# EAGLE board SparkFun_Stepoko (EAGLE 7.1.0)
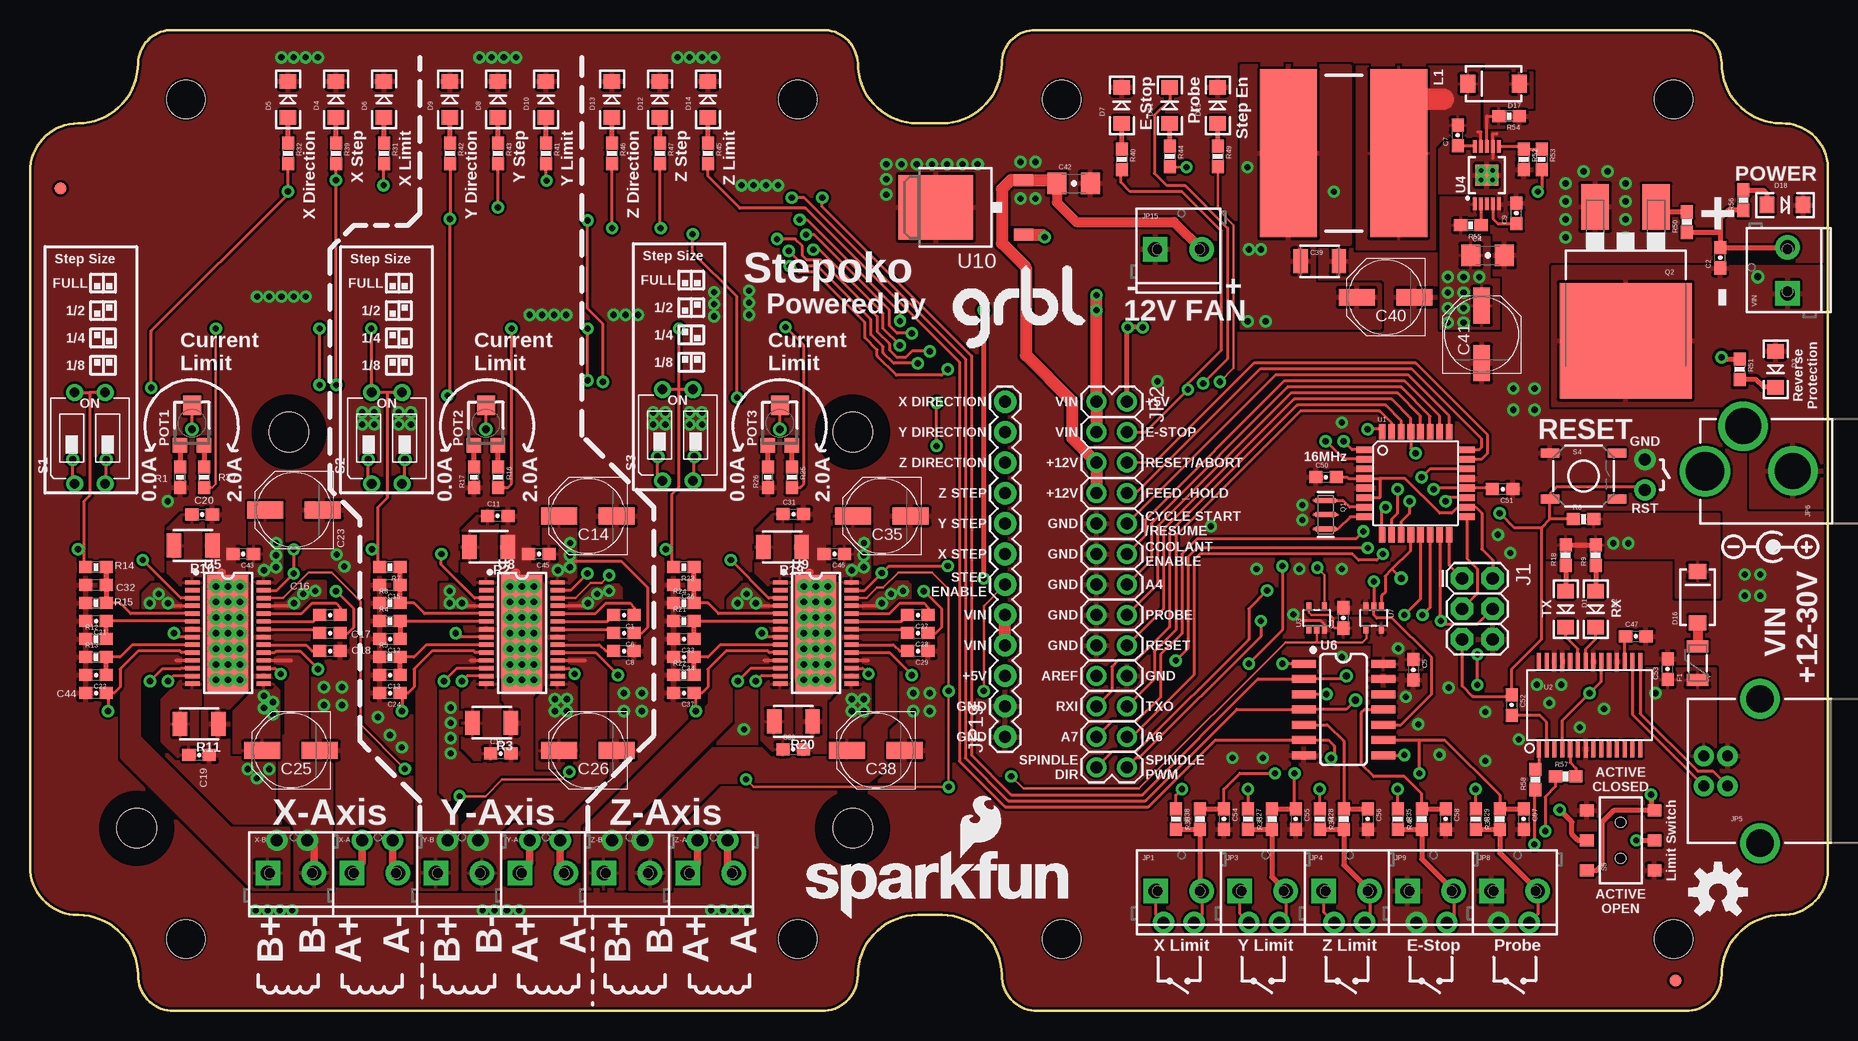
[diagram p2: board, top side]
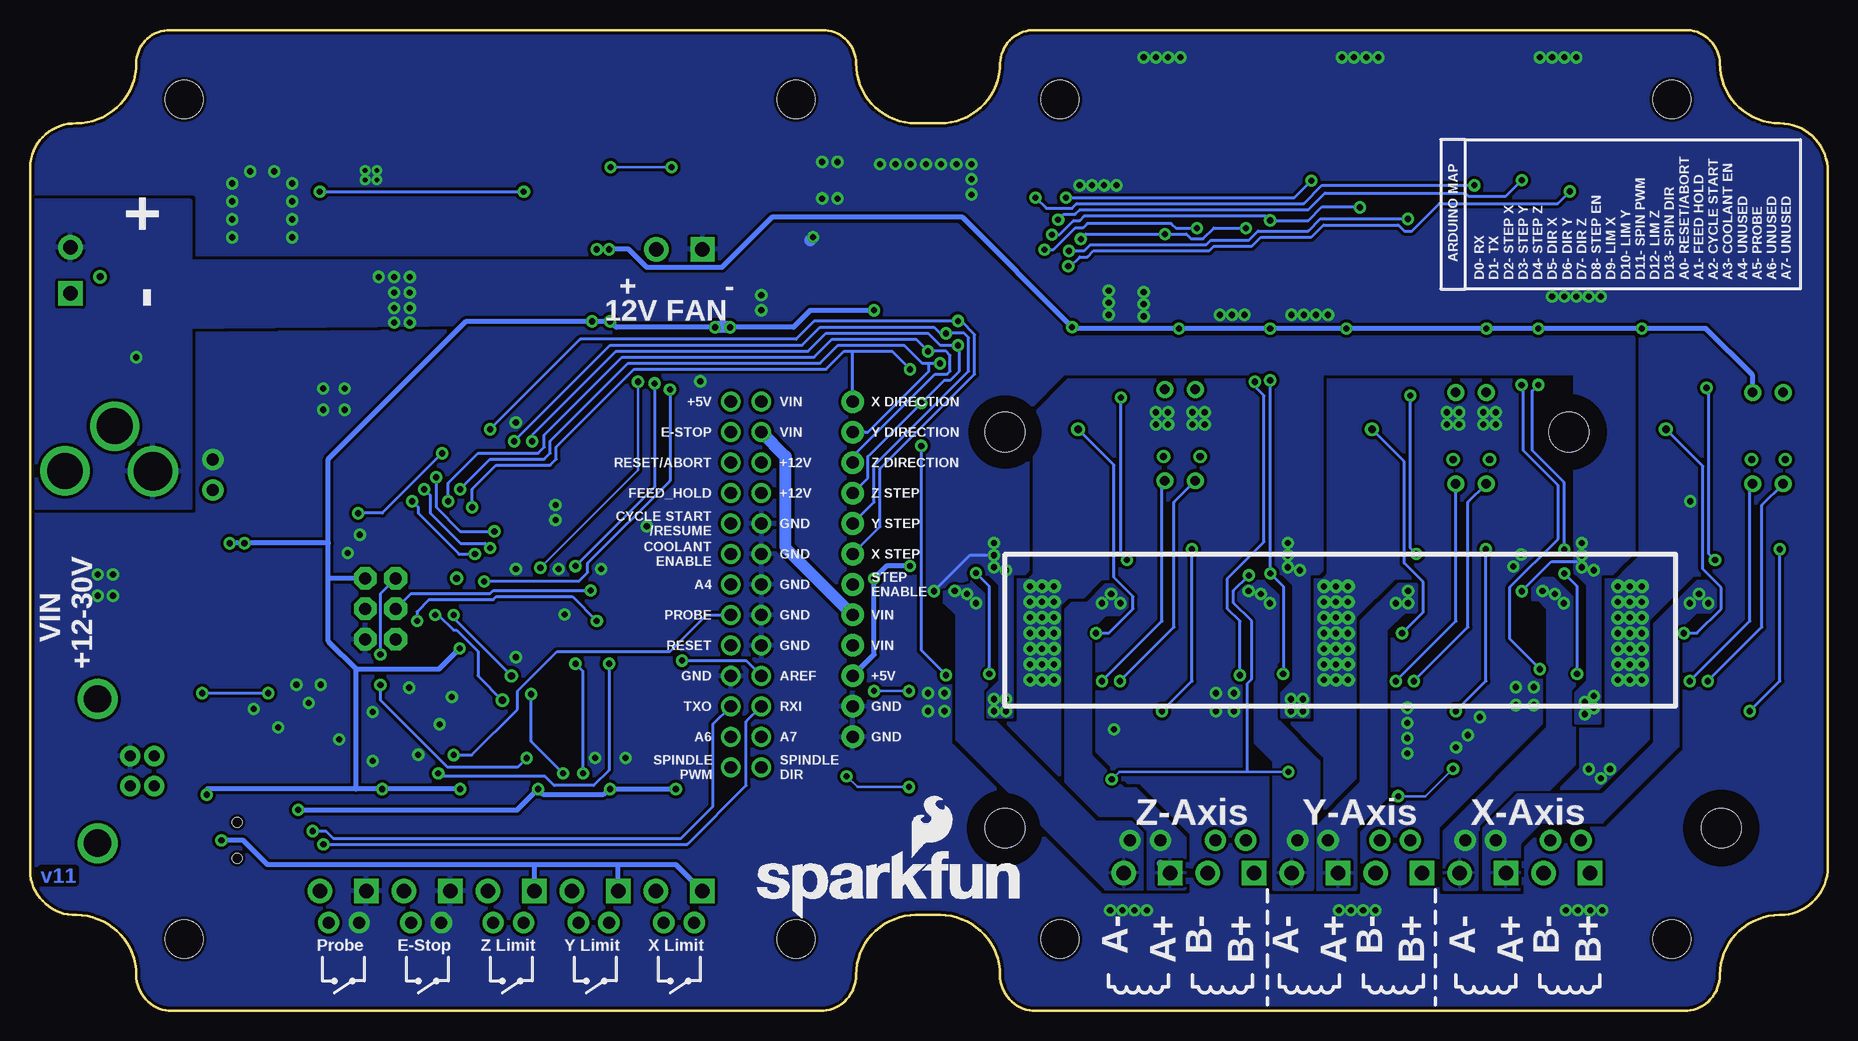
[diagram p3: board, bottom side, seen from below]

Size 149.86 x 81.79 mm. Coordinates in mm from the lower left corner, seen from the top.
Copper layers (1*16): Top 0.035mm / dielectric 1.5mm / Bottom 0.035mm
Design rules "SparkFun-2-layer": minimum track width 7mil, minimum drill 15mil, track to track 8mil, track to pad 8mil, pad to pad 8mil, via to via 8mil, smd to smd 8mil, copper to edge 8mil, drill to drill 8mil, minimum pad ring 12mil, minimum via ring 10mil, stop-mask expansion 4mil, vias tented up to drill 20mil, thermal gap 10mil
tRestrict: area 6.1,12.4 to 11.7,18; area 65.8,12.4 to 71.4,18; area 65.8,45.5 to 71.4,51.1; area 18.8,45.5 to 24.4,51.1; 1 lines
bRestrict: area 18.8,45.5 to 24.4,51.1; area 65.8,12.4 to 71.4,18; area 6.1,12.4 to 11.7,18; area 65.9,45.6 to 71.2,50.9

## Footprints (pad centres in the part's own frame; a part is rotated, then mirrored left to right if it is on the bottom)
0603-CAP = smd 1.1 x 1: 1 -0.85,0; 2 0.85,0
1206-CAP = smd 1.6 x 1.8: 1 -1.4,0; 2 1.4,0
PANASONIC_D = smd 3 x 1.4: + 2.4,0; - -2.4,0
0603 = smd 1.1 x 1: 1 -0.85,0; 2 0.85,0
1210 = smd 1.2 x 2: 1 -1.6,0; 2 1.6,0
LED-1206 = smd 1.2 x 1.4: A -1.5,0; C 1.5,0
SMA-DIODE = smd 1.27 x 1.47: A -2.15,0; C 2.15,0
PTC-1206 = smd 1 x 1.8: 1 -1.4,0; 2 1.4,0
FIDUCIAL-1X2 = smd 1 x 1: 1 0,0
2X3 = drill 1.016 pad 1.88 octagon: 1 0,0; 2 0,2.54; 3 2.54,0; 4 2.54,2.54; 5 5.08,0; 6 5.08,2.54
SCREWTERMINAL-3.5MM-2_LOCK = drill 1.2 pad 2.032 square: 1 -0.178,0 | drill 1.2 pad 2.032: 2 3.678,0
2X13 = drill 1.016 pad 1.651: 1 0,0; 2 0,2.54; 3 2.54,0; 4 2.54,2.54; 5 5.08,0; 6 5.08,2.54; 7 7.62,0; 8 7.62,2.54; 9 10.16,0; 10 10.16,2.54; 11 12.7,0; 12 12.7,2.54; 13 15.24,0; 14 15.24,2.54; 15 17.78,0; 16 17.78,2.54; 17 20.32,0; 18 20.32,2.54; 19 22.86,0; 20 22.86,2.54; 21 25.4,0; 22 25.4,2.54; 23 27.94,0; 24 27.94,2.54; 25 30.48,0; 26 30.48,2.54
USB-B-PTH = drill 0.914 pad 1.676: D+ 0,1.25; D- 1.981,1.25; GND 0,-1.25; VBUS 1.981,-1.25 | drill 2.286: S1 -2.718,-6.02; S2 -2.718,6.02
POWER_JACK_PTH_LOCK = drill 2.997 pad 4.115: GND 0.025,6.557; GNDBREAK 3.762,10.7 | drill 3.2 pad 4.115: PWR 0,13.878
1X12 = drill 1.016 pad 1.88: 1 0,0; 2 2.54,0; 3 5.08,0; 4 7.62,0; 5 10.16,0; 6 12.7,0; 7 15.24,0; 8 17.78,0; 9 20.32,0; 10 22.86,0; 11 25.4,0; 12 27.94,0
INDUCTOR_SDR1307 = smd 14 x 4.75: P$1 0,4.6; P$2 0,-4.6
TC33X = smd 1.2 x 1.2: 1 -1,-1.825; 3 1,-1.825 | smd 1.5 x 1.6: 2 0,1.5
RESONATOR-SMD = smd 0.45 x 1.905: 1 -1.2,0; 2 0,0; 3 1.2,0
TO-263/D2PAK = smd 2.32 x 3.81: 1 -2.54,-7.045; 3 2.54,-7.045 | smd 11 x 9.65: 2 0,4.125
0603-RES = smd 1.1 x 1: 1 -0.85,0; 2 0.85,0
0603-RES@1 = smd 1.1 x 1: 1 -0.85,0; 2 0.85,0
209-2LPST = drill 0.8: 1 -1.27,-3.81; 2 1.27,-3.81; 3 1.27,3.81; 4 -1.27,3.81
TACTILE-SWITCH-SMD = smd 1.524 x 0.762: 1 -2.794,1.905; 2 2.794,1.905; 3 -2.794,-1.905; 4 2.794,-1.905
AYZ0202 = smd 1 x 1.15: 1 -2.5,2.825; 2 0,2.825; 3 2.5,2.825; 4 -2.5,-2.825; 5 0,-2.825; 6 2.5,-2.825 | hole 0.85: 1.5,0; -1.5,0
TQFP32-08@1 = smd 1.27 x 0.559: 1 -4.293,2.8; 2 -4.293,2; 3 -4.293,1.2; 4 -4.293,0.4; 5 -4.293,-0.4; 6 -4.293,-1.2; 7 -4.293,-2; 8 -4.293,-2.8; 17 4.293,-2.8; 18 4.293,-2; 19 4.293,-1.2; 20 4.293,-0.4; 21 4.293,0.4; 22 4.293,1.2; 23 4.293,2; 24 4.293,2.8 | smd 0.559 x 1.27: 9 -2.8,-4.293; 10 -2,-4.293; 11 -1.2,-4.293; 12 -0.4,-4.293; 13 0.4,-4.293; 14 1.2,-4.293; 15 2,-4.293; 16 2.8,-4.293; 25 2.8,4.293; 26 2,4.293; 27 1.2,4.293; 28 0.4,4.293; 29 -0.4,4.293; 30 -1.2,4.293; 31 -2,4.293; 32 -2.8,4.293
SSOP28DB = smd 0.348 x 1.397: 1 -4.225,-3.656; 2 -3.575,-3.656; 3 -2.925,-3.656; 4 -2.275,-3.656; 5 -1.625,-3.656; 6 -0.975,-3.656; 7 -0.325,-3.656; 8 0.325,-3.656; 9 0.975,-3.656; 10 1.625,-3.656; 11 2.275,-3.656; 12 2.925,-3.656; 13 3.575,-3.656; 14 4.225,-3.656; 15 4.225,3.656; 16 3.575,3.656; 17 2.925,3.656; 18 2.275,3.656; 19 1.625,3.656; 20 0.975,3.656; 21 0.325,3.656; 22 -0.325,3.656; 23 -0.975,3.656; 24 -1.625,3.656; 25 -2.275,3.656; 26 -2.925,3.656; 27 -3.575,3.656; 28 -4.225,3.656
SOT353 = smd 0.42 x 0.7: 1 -0.65,-0.95; 2 0,-0.95; 3 0.65,-0.95; 4 0.65,0.95; 5 -0.65,0.95
HVSS0P-10 = smd 0.3 x 1.02: 1 -1,-2.4; 2 -0.5,-2.4; 3 0,-2.4; 4 0.5,-2.4; 5 1,-2.4; 6 1,2.4; 7 0.5,2.4; 8 0,2.4; 9 -0.5,2.4; 10 -1,2.4 | smd 1.905 x 1.727: PAD 0,0
HTSSOP28 = smd 0.36 x 1.19: 1 -4.225,-2.97; 2 -3.575,-2.97; 3 -2.925,-2.97; 4 -2.275,-2.97; 5 -1.625,-2.97; 6 -0.975,-2.97; 7 -0.325,-2.97; 8 0.325,-2.97; 9 0.975,-2.97; 10 1.625,-2.97; 11 2.275,-2.97; 12 2.925,-2.97; 13 3.575,-2.97; 14 4.225,-2.97; 15 4.225,2.97; 16 3.575,2.97; 17 2.925,2.97; 18 2.275,2.97; 19 1.625,2.97; 20 0.975,2.97; 21 0.325,2.97; 22 -0.325,2.97; 23 -0.975,2.97; 24 -1.625,2.97; 25 -2.275,2.97; 26 -2.925,2.97; 27 -3.575,2.97; 28 -4.225,2.97 | drill 0.508: GND@10 -3.9,1; GND@11 -3.9,0; GND@12 -3.9,-1; GND@13 -2.6,-1; GND@14 -2.6,0; GND@15 -2.6,1; GND@16 -1.3,1; GND@17 -1.3,0; GND@18 -1.3,-1; GND@19 0,-1; GND@20 0,0; GND@21 0,1; GND@22 1.3,1; GND@23 1.3,0; GND@24 1.3,-1; GND@25 2.6,-1; GND@26 2.6,0; GND@27 2.6,1; GND@28 3.9,1; GND@29 3.9,0; GND@30 3.9,-1 | smd 9.7 x 3.4: GND@PAD 0,0
SOIC-14 = smd 0.66 x 2.032: 1 -4.445,-3.315; 2 -3.175,-3.315; 3 -1.905,-3.315; 4 -0.635,-3.315; 5 0.635,-3.315; 6 1.905,-3.315; 7 3.175,-3.315; 8 3.175,3.315; 9 1.905,3.315; 10 0.635,3.315; 11 -0.635,3.315; 12 -1.905,3.315; 13 -3.175,3.315; 14 -4.445,3.315
TO-252 = smd 1 x 1.6: 1 -2.28,-4.8; 2 2.28,-4.8 | smd 5.4 x 6.2: 3 0,2.5
FLANGED_RED_ENCLOSURE-DIMENSION-NO-INNER-HOLES = hole 3.175: 64,6; 86,6; 137,6; 13,6; 64,76; 86,76; 137,76; 13,76
STAND-OFF = hole 3.302: 0,0

## Placement (x,y rotation side)
C1  0.22uF  [0603-CAP]  49.5,33 180 top
C2  0.1uF  [0603-CAP]  140.89,62.8 90 top
C3  0.1uF  [0603-CAP]  109.47,32.77 90 top
C4  1.0uF  [1206-CAP]  121.5,63 0 top
C5  0.1uF  [0603-CAP]  115.32,28.45 270 top
C6  0.22uF  [0603-CAP]  49.5,31.5 180 top
C7  0.1uF  [0603-CAP]  119,73 90 top
C8  0.22uF  [0603-CAP]  49.5,30 180 top
C9  10nF  [0603-CAP]  123.9,66.5 90 top
C10  0.1uF  [0603-CAP]  39.24,21.46 0 top
C11  0.1uF  [0603-CAP]  38.99,41.28 0 top
C12  1nF  [0603-CAP]  30,31 180 top
C13  1nF  [0603-CAP]  30,28 180 top
C14  47uF  [PANASONIC_D]  46.51,41.27 180 top
C15  0.18uF  [0603]  30,35.5 180 top
C16  0.22uF  [0603-CAP]  25,33 180 top
C17  0.22uF  [0603-CAP]  25,31.5 180 top
C18  0.22uF  [0603-CAP]  25,30 180 top
C19  0.1uF  [0603-CAP]  14.09,21.34 0 top
C20  0.1uF  [0603-CAP]  14.35,41.4 0 top
C21  1nF  [0603-CAP]  5.5,32.5 180 top
C22  1nF  [0603-CAP]  5.5,28 180 top
C23  47uF  [PANASONIC_D]  22.01,41.78 180 top
C24  0.1uF  [0603-CAP]  30,26.5 180 top
C25  47uF  [PANASONIC_D]  21.75,21.73 180 top
C26  47uF  [PANASONIC_D]  46.51,21.73 180 top
C27  0.22uF  [0603-CAP]  74,33 180 top
C28  0.22uF  [0603-CAP]  74,31.5 180 top
C29  0.22uF  [0603-CAP]  74,30 180 top
C30  0.1uF  [0603-CAP]  63.62,21.83 0 top
C31  0.1uF  [0603-CAP]  63.63,41.42 0 top
C32  0.18uF  [0603]  5.5,35.5 180 top
C33  1nF  [0603-CAP]  54.5,31 180 top
C34  1nF  [0603-CAP]  54.5,29.5 180 top
C35  47uF  [PANASONIC_D]  71.01,41.27 180 top
C36  0.18uF  [0603]  54.5,35.5 180 top
C37  0.1uF  [0603-CAP]  54.5,26.5 180 top
C38  47uF  [PANASONIC_D]  70.5,21.73 180 top
C39  22uF  [1210]  107.5,62.5 0 top
C40  47uF  [PANASONIC_D]  113,59.5 180 top
C41  47uF  [PANASONIC_D]  121,56.4 90 top
C42  1.0uF  [1206-CAP]  87,69 0 top
C43  0.1uF  [0603-CAP]  17.78,38.1 180 top
C44  0.1uF  [0603-CAP]  5.5,26.5 180 top
C45  0.1uF  [0603-CAP]  42.42,38.1 180 top
C46  0.1uF  [0603-CAP]  67.06,38.1 180 top
C47  0.1uF  [0603-CAP]  133.86,31.24 0 top
C50  0.1uF  [0603-CAP]  108.04,44.5 0 top
C51  0.1uF  [0603-CAP]  122.75,43.5 180 top
C52  0.1uF  [0603-CAP]  123.5,25.5 270 top
C53  0.1uF  [0603-CAP]  136.5,28.5 90 top
C54  0.1uF  [0603-CAP]  99.52,16 270 top
C55  0.1uF  [0603-CAP]  105.51,16 270 top
C56  0.1uF  [0603-CAP]  111.5,16 270 top
C57  0.1uF  [0603-CAP]  124.5,16 270 top
C58  0.1uF  [0603-CAP]  118,16 270 top
D1  RED  [LED-1206]  128,33.5 270 top
D2  GREEN  [LED-1206]  130.5,33.5 270 top
D3  RED  [LED-1206]  145.5,53.5 270 top
D4  GREEN  [LED-1206]  25.5,76 90 top
D5  RED  [LED-1206]  21.5,76 90 top
D6  Yellow  [LED-1206]  29.5,76 90 top
D7  RED  [LED-1206]  91,75.5 90 top
D8  GREEN  [LED-1206]  39,76 90 top
D9  RED  [LED-1206]  35,76 90 top
D10  Yellow  [LED-1206]  43,76 90 top
D11  BLUE  [LED-1206]  95,75.5 90 top
D12  GREEN  [LED-1206]  52.5,76 90 top
D13  RED  [LED-1206]  48.5,76 90 top
D14  Yellow  [LED-1206]  56.5,76 90 top
D15  GREEN  [LED-1206]  99,75.5 90 top
D16  MBRA140  [SMA-DIODE]  139,34.5 90 top
D17  MBRA140  [SMA-DIODE]  122,77.31 180 top
D18  BLUE  [LED-1206]  146.3,67.2 0 top
F1  PTCSMD  [PTC-1206]  139,29 90 top
FID1  FIDUCIAL1X2  [FIDUCIAL-1X2]  2.54,68.58 0 top
FID2  FIDUCIAL1X2  [FIDUCIAL-1X2]  137.16,2.54 0 top
FRAME1  FRAME-LEDGER  [CREATIVE_COMMONS]  68.5,-9 0 top  (outside the outline)
FRAME2  FRAME-LEDGER  [CREATIVE_COMMONS]  68.5,-9 0 top  (outside the outline)
J1  AVR ISP  [2X3]  119.38,36.07 270 top
JP1  3.5mm  [SCREWTERMINAL-3.5MM-2_LOCK]  94,10 0 top
JP2  [2X13]  88.9,50.8 270 top
JP3  3.5mm  [SCREWTERMINAL-3.5MM-2_LOCK]  101,10 0 top
JP4  3.5mm  [SCREWTERMINAL-3.5MM-2_LOCK]  108,10 0 top
JP5  USB-B  [USB-B-PTH]  141.5,20 180 top
JP6  POWER  [POWER_JACK_PTH_LOCK]  153.5,45 90 top
JP8  3.5mm  [SCREWTERMINAL-3.5MM-2_LOCK]  122,10 0 top
JP9  3.5mm  [SCREWTERMINAL-3.5MM-2_LOCK]  115,10 0 top
JP15  3.5mm  [SCREWTERMINAL-3.5MM-2_LOCK]  93.98,63.5 0 top
JP19  [1X12]  81.28,22.86 90 top
L1  27uH  [INDUCTOR_SDR1307]  109.5,71.5 270 top
LOGO1  OSHW-LOGOM  [OSHW-LOGO-M]  140.72,9.91 0 top
LOGO2  SFE_LOGO_NAME_FLAME.2_INCH  [SFE_LOGO_NAME_FLAME_.2@1]  64.01,7.62 0 top
LOGO3  SFE_LOGO_NAME_FLAME.2_INCH  [SFE_LOGO_NAME_FLAME_.2]  89.92,7.62 0 bottom
POT1  10K_LINEAR_POT_SMD  [TC33X]  13.5,49 0 top
POT2  10K_LINEAR_POT_SMD  [TC33X]  38,49 0 top
POT3  10K_LINEAR_POT_SMD  [TC33X]  62.5,49 0 top
Q1  16MHZ  [RESONATOR-SMD]  108,41.37 270 top
Q2  100A/100V  [TO-263/D2PAK]  133,60 180 top
R1  0  [0603]  12.5,44.5 90 top
R2  0.1  [1210]  38.23,38.7 180 top
R3  0.1  [1210]  38.48,24.04 180 top
R4  39K  [0603]  30,32.5 0 top
R5  39K  [0603]  30,29.5 0 top
R6  10K  [0603-RES]  129.5,41 0 top
R7  5.6K  [0603]  30,37 180 top
R8  5.6K  [0603]  30,34 0 top
R9  1K  [0603-RES@1]  130.5,38 90 top
R10  0.1  [1210]  13.59,38.82 180 top
R11  0.1  [1210]  14.1,23.92 180 top
R12  39K  [0603]  5.5,31 0 top
R13  39K  [0603]  5.5,29.5 0 top
R14  5.6K  [0603]  5.5,37 180 top
R15  5.6K  [0603]  5.5,34 0 top
R16  10K  [0603-RES]  39,44.5 270 top
R17  0  [0603]  37,44.5 90 top
R18  1K  [0603-RES@1]  128,38 90 top
R19  0.1  [1210]  62.71,38.68 180 top
R20  0.1  [1210]  63.63,24.15 180 top
R21  39K  [0603]  54.5,32.5 0 top
R22  39K  [0603]  54.5,28 0 top
R23  5.6K  [0603]  54.5,37 180 top
R24  5.6K  [0603]  54.5,34 0 top
R25  10K  [0603-RES]  63.5,44.5 270 top
R26  0  [0603]  61.5,44.5 90 top
R27  10K  [0603-RES]  101.51,16 270 top
R28  10K  [0603-RES]  107.5,16 270 top
R29  10K  [0603-RES]  120.5,16 270 top
R30  1K  [0603-RES@1]  97.52,16 90 top
R31  1K  [0603-RES]  29.5,71.5 270 top
R32  1K  [0603-RES]  21.5,71.5 270 top
R33  1K  [0603-RES@1]  103.51,16 90 top
R34  1K  [0603-RES@1]  109.5,16 90 top
R35  10K  [0603-RES]  114,16 270 top
R36  1K  [0603-RES@1]  122.5,16 90 top
R37  10K  [0603-RES]  14.5,44.5 270 top
R38  10K  [0603-RES]  95.52,16 270 top
R39  1K  [0603-RES]  25.5,71.5 270 top
R40  1K  [0603-RES]  91,71 270 top
R41  1K  [0603-RES]  43,71.5 270 top
R42  1K  [0603-RES]  35,71.5 270 top
R43  1K  [0603-RES]  39,71.5 270 top
R44  1K  [0603-RES]  95,71.25 270 top
R45  1K  [0603-RES]  56.5,71.5 270 top
R46  1K  [0603-RES]  48.5,71.5 270 top
R47  1K  [0603-RES]  52.5,71.5 270 top
R48  1K  [0603-RES@1]  116,16 90 top
R49  1K  [0603-RES]  99,71.25 270 top
R50  1K  [0603-RES@1]  138.12,65.77 90 top
R51  10K  [0603-RES]  142.5,53.5 270 top
R52  10K  [0603-RES]  124.5,71 270 top
R53  9.76K  [0603]  126,71 270 top
R54  50.0m  [0603]  123.3,74.61 180 top
R55  348K  [0603]  120.1,65.5 180 top
R56  10K  [0603-RES]  142.8,67.6 90 top
R57  1K  [0603-RES@1]  128.02,19.56 0 top
R58  1K  [0603-RES@1]  125.48,19.3 90 top
S1  2-POS-DIPCTS-THRU-HOLE  [209-2LPST]  4.99,47.76 0 top
S2  2-POS-DIPCTS-THRU-HOLE  [209-2LPST]  29.75,47.76 0 top
S3  2-POS-DIPCTS-THRU-HOLE  [209-2LPST]  53.99,48.02 0 top
S4  Reset  [TACTILE-SWITCH-SMD]  129.5,44.6 0 top
S5  DPDT  [AYZ0202]  132.59,14.22 90 top
U1  ATMEGA328  [TQFP32-08@1]  115.5,44 0 top
U2  FT232RLSSOP  [SSOP28DB]  130,25.5 0 top
U3  74LVC1G04  [SOT353]  107.25,32.77 0 top
U4  LM25011  [HVSS0P-10]  121.44,69.68 0 top
U5  DRV8811  [HTSSOP28]  16.5,31.5 270 top
U6  74HC7014D  [SOIC-14]  109.5,24.5 270 top
U7  7432SE  [SOT353]  112.01,32.77 180 top
U8  DRV8811  [HTSSOP28]  41,31.5 270 top
U9  DRV8811  [HTSSOP28]  65.5,31.5 270 top
U10  +12v  [TO-252]  78,67 90 top
U$1  [FLANGED_RED_ENCLOSURE-DIMENSION-NO-INNER-HOLES]  0,0 0 top
U$2  [STAND-OFF]  68.58,48.26 0 top
U$3  [STAND-OFF]  68.58,15.24 0 top
U$4  [STAND-OFF]  21.59,48.26 0 top
U$5  [STAND-OFF]  8.89,15.24 0 top
VIN  3.5mm  [SCREWTERMINAL-3.5MM-2_LOCK]  146.5,60 90 top
X-A  3.5mm  [SCREWTERMINAL-3.5MM-2_LOCK]  27,11.5 0 top
X-B  3.5mm  [SCREWTERMINAL-3.5MM-2_LOCK]  20,11.5 0 top
Y-A  3.5mm  [SCREWTERMINAL-3.5MM-2_LOCK]  41,11.5 0 top
Y-B  3.5mm  [SCREWTERMINAL-3.5MM-2_LOCK]  34,11.5 0 top
Z-A  3.5mm  [SCREWTERMINAL-3.5MM-2_LOCK]  55,11.5 0 top
Z-B  3.5mm  [SCREWTERMINAL-3.5MM-2_LOCK]  48,11.5 0 top

## Tracks (layer width: path | path; a pad name or v marks a point on that pad's centre or on a via)
5V  (via drill 0.51, 0.51 pad 0.25)
  Top 0.203: U3.5 106.6,33.23 106.81,33.02 108.33,33.02 108.58,32.77 108.58,32.07 108.74,31.92 C3.1 | 95.05,70.36 v96.39,70.36 | v101.47,70.36 101.66,70.36 | v15.49,56.9 15.49,43.94 15.2,43.65 R37.2
  Top 0.254: U5.10 12.62,29.88 12.5,30 9,30 7.5,28.5 7.5,27 7,26.5 C44.1 | U5.17 20.43,28.57 v20.9,28.1 | 55,26.5 C37.1 55.5,26.5 | U8.17 44.92,28.57 v45.4,28.1 | U9.17 69.42,28.57 v69.9,28.1 | U8.10 37.12,29.88 37,30 33.5,30 32,28.5 32,27 31.5,26.5 C24.1 | U9.10 61.62,29.88 61.5,30 58,30 56.5,28.5 56.5,27 56,26.5 55.5,26.5 | 4.5,37.15 4.5,38.5 | 29,37.15 29,38.5 | 53.5,37.15 53.5,38.5 | v53,38.5 53.5,38.5 | v55.5,25 55.5,26.5 | v28.5,38.5 29,38.5 | v4,38.5 4.5,38.5 | 6.5,26.35 v6.5,25 | 31,26.35 v31,25 | R53.2 126,68.62 v125.7,68.32 | U1.4 111.25,44.4 | 111.25,44.4 112.5,44.4 | 112.5,44.4 112.5,42.8 U1.6 | 112.5,44.4 114.6,44.4 117.5,41.5 118.5,41.5 119,42 U1.18 120.5,42 121,41.5 121,38.51 121.92,37.59 J1.2 | 63.5,43.5 R25.2 64.22,43.65 64.52,43.94 64.52,55.5 v62.99,57.02 | R29.1 v120.5,18.5 | R35.1 v114,18.5 | 53.5,38.5 53.5,43.09 54.1,43.69 54.1,51.83 | 4.5,38.5 4.5,42.5 5,43 5,51.57 | 29,38.5 29,42 29.8,42.8 29.8,51.57 | R44.2 95.05,70.36 | C50.2 109.8,44.5 109.92,44.39 111.24,44.39 111.25,44.4 | U8.27 45.07,35.08 v46.46,36.47 | U5.27 20.57,35.08 v21.97,36.48 v21.97,38.48 | U9.27 69.57,35.08 v71,36.51 71.59,37.1 v76.5,37.1 | S1.4 4.95,51.57 | 4.95,51.57 4.96,51.57 | 4.96,51.57 5,51.57 | S2.3 29.8,51.57 | 54.1,51.83 S3.3 55.89,51.83 | R16.2 39.84,43.65 40.13,43.94 v40.13,56.9 | 29.8,51.57 S2.4 28.48,56.87 v28.45,56.9 | S1.3 5,51.57 | v24.13,52.2 v24.13,56.9 | v46.48,52.58 v46.48,56.9 | 4.96,51.57 4.95,51.56 4.95,51.57 | 54.1,51.83 v54.1,56.9 | 54.1,51.83 S3.4
  Top 0.406: R18.2 R9.2 | 14.65,43.5 R37.2 | R16.2 39,43.5 | R14.2 4.5,37.15 | R7.2 29,37.15 | R23.2 53.5,37.15 | C44.1 6.5,26.35 | C24.1 31,26.35 | v92.75,57 91.44,57 JP2.2 | S5.1 130.6,11.72 131.06,12.19 131.06,15.75 132.08,16.76 135.13,16.76 | 135.13,16.76 135.37,16.76 S5.6 | v135.13,18.03 135.13,16.76 | v79.5,36.07 v79.5,58.42 | v102.62,63.5 102.36,63.5 102.49,63.63
  Bottom 0.203: v96.39,70.36 v101.47,70.36
  Bottom 0.254: v20.9,28.1 20.9,35.41 v21.97,36.48 | v69.9,28.1 69.9,35.41 v71,36.51 | v55.5,25 53,27.5 v53,38.5 | v31,25 28.5,27.5 v28.5,38.5 | v6.5,25 4,27.5 v4,38.5 | v125.7,68.32 v108.7,68.32 | v45.4,28.1 45.4,35.41 v46.46,36.47 46.5,36.51 46.48,36.53 v46.48,52.58 | v21.97,38.48 21.97,44.07 24.64,46.74 24.64,51.69 v24.13,52.2
  Bottom 0.406: 125,39 v131.98,39 v133.22,39 | 125,36.07 125,30.83 122.68,28.51 | 125,36.07 125,39 | 125,39 125,46 113.5,57.5 v103,57.5 v101.5,57.5 101,57 v92.75,57 | v91.5,57 86.22,57 84.8,58.42 v79.5,58.42 | JP19.3 79.5,29.72 v79.5,36.07 78.47,37.1 v76.5,37.1 | v114,18.5 v120.5,18.5 122.68,18.5 | 122.68,18.5 122.68,28.51 | 122.68,18.5 135.13,18.5 v135.13,18.03 | 122.68,28.51 115.76,28.51 v114.05,30.23 | J1.2 125,36.07 | v102.62,63.5 99.95,63.5 98.42,61.98 92.2,61.98 88.01,66.17 72.14,66.17 v62.99,57.02 62.87,56.9 v54.1,56.9 v46.48,56.9 v40.13,56.9 v28.45,56.9 v24.13,56.9 v15.49,56.9 10.16,56.9 6.26,53 S1.3
  Bottom 1.016: v91.5,57 v92.75,57
  other vias: 101.6,63.5
  pour Top (isolate 0.254): 129.5,41.4 129.5,40.6 126.4,40.6 126.4,37.8 137.2,37.8 137.2,34.5 140.8,34.5 140.8,41.4
  pour Top: 101,57 112.5,57 112.5,60.5 107,60.5 107,64 110,64 110,78.73 101,78.73
  pour Top: 112.01,28.45 116.08,28.45 116.08,30.23 113.54,32.77 108.78,32.77 108.78,30.73 112.01,30.73
A0-RESET/ABORT
  Top 0.203: 93.72,45.72 JP2.6
  Top 0.254: U1.23 121,46 121.5,46.5 121.5,48 115.5,54 102,54 93.72,45.72
A1-FEED_HOLD
  Top 0.254: U1.24 120.8,46.8 121,47 121,47.7 115.2,53.5 102.5,53.5 92.18,43.18 JP2.8
A2-CYCLE_START/RESUME
  Top 0.254: U1.25 118.3,49.6 114.9,53 103.8,53 JP2.10
A3-COOLANT_ENABLE
  Top 0.254: U1.26 117.5,49.6 114.6,52.5 104.52,52.5 92.96,40.95 92.96,39.62 JP2.12
A4
  Top 0.254: U1.27 116.7,49.6 114.3,52 104.83,52 93.47,40.64 93.47,37.59 JP2.14
A5-PROBE  (via drill 0.51)
  Top 0.254: U1.28 115.9,49.6 114,51.5 105.09,51.5 93.98,40.39 93.98,35.56 JP2.16 | U6.8 114.54,21.32 v114.55,21.34
  Bottom 0.254: v114.55,21.34 113.03,21.34 109.22,25.15 109.22,26.67 105.92,29.97 96.52,29.97 93.47,33.02 JP2.16
A6  (via drill 0.51)
  Top 0.254: U1.19 118.3,42.8 v118,42.5 | JP2.24 91.86,22.86 97.03,28.03 97.03,37.59 97.54,38.1 110.24,38.1 110.74,37.59 112.27,37.59 v112.78,38.1
  Bottom 0.254: v118,42.5 117.5,42 117.5,41.5 114.1,38.1 v112.78,38.1
A7  (via drill 0.51)
  Top 0.254: U1.22 116.7,45.2 v116,44.5 | JP2.23 90.17,24.13 92.2,24.13 94.23,26.16 94.23,29.72 96.01,31.5 96.01,38.1 97.28,39.37 110.53,39.37 v111.15,39.99
  Bottom 0.254: v116,44.5 116,42 113.99,39.99 v111.15,39.99
AREF  (via drill 0.51)
  Top 0.254: v117,43.5 117.1,43.6 U1.20 121.8,43.6 C51.2 | v111.51,38.61 97.28,38.61 96.52,37.85 96.52,30.23 v95.5,29.21
  Bottom 0.254: v117,43.5 116.5,43 116.5,41.5 113.98,38.98 111.88,38.98 v111.51,38.61 | v95.5,29.21 90.17,29.21 JP2.19
D2-STEP-X  (via drill 0.51, 0.51 pad 0.25)
  Top 0.254: U5.19 20.38,29.88 20.5,30 22.5,30 v24,28.5 | R39.2 v25.5,69.27 25.5,52.22 v25.53,52.2 | v64.16,65.97 64.79,65.97 72.52,58.24 v72.52,57.53 72.52,57.5 | U1.32 112.49,48.5 v111.5,48.5
  Bottom 0.254: v24,28.5 26.5,31 26.5,35.35 22.48,39.37 22.48,43.81 25.4,46.74 25.4,52.07 v25.53,52.2 | 72.49,57.5 84.5,57.5 86,56 104,56 v111.5,48.5 | JP19.7 78.99,40.39 78.99,45.21 71.12,53.09 71.12,56.39 72.23,57.5 72.49,57.5 | v64.16,65.97 63.71,66.42 62.74,66.42 62.36,66.8 43.31,66.8 41.91,68.2 30.23,68.2 29.97,67.94 26.82,67.94 v25.5,69.27 | v72.52,57.53 72.49,57.5
D3-STEP-Y  (via drill 0.51, 0.51 pad 0.25)
  Top 0.254: U8.19 47.12,29.88 v49,28 | v39,67 R43.2 | U1.1 110.2,46.8 v109.5,47.5 | v73.5,56.5 72.28,56.5 71.63,57.15 71.63,58.42 65.33,64.71 v64.68,64.71 | v47.75,52.45 47.75,57.28 46.48,58.55 v46.48,65.91
  Bottom 0.254: v49,28 49,32.5 50.04,33.54 50.04,36.07 46.99,39.12 46.99,51.31 47.75,52.07 v47.75,52.45 | v109.5,47.5 101.5,55.5 85.5,55.5 84,57 74.5,57 74,56.5 v73.5,56.5 71.99,56.5 71.63,56.13 71.63,53.34 79.5,45.47 79.5,42.42 JP19.8 | v64.68,64.71 64.06,64.71 62.87,65.91 62.36,65.91 61.98,66.29 46.86,66.29 v46.48,65.91 43.31,65.91 42.16,67.06 39.06,67.06 v39,67
D4-STEP-Z  (via drill 0.51, 0.51 pad 0.25)
  Top 0.254: U9.19 71.62,29.88 v73.5,28 | U1.2 109.5,46 v108,47.5 | v72.5,55.5 72.5,55.52 71.12,56.9 71.12,58.17 65.82,63.47 v65.29,63.47 | v52.58,65.28 52.5,65.36 R47.2 | v75.56,47.12 v75.56,50.67
  Bottom 0.254: v73.5,28 75.56,30.07 v75.56,47.12 | v108,47.5 108,48 101,55 85,55 83.5,56.5 75,56.5 74,55.5 v72.5,55.5 72.39,55.5 72.39,53.34 73.15,52.58 73.66,52.58 v75.56,50.67 80.01,46.23 80.01,44.45 JP19.9 | v65.29,63.47 64.55,63.47 62.74,65.28 62.1,65.28 61.72,65.66 54.74,65.66 54.36,65.28 v52.58,65.28
D5-DIR-X  (via drill 0.51, 0.51 pad 0.25)
  Top 0.254: U5.3 12.57,34.42 v9.41,37.59 v9.4,37.59 | U1.9 112.7,41.7 v113,42 | v76.5,53.5 76,53 72.22,53 70.61,54.61 70.61,55.12 69.6,56.13 69.6,57.4 65.41,61.59 64.14,61.59 63.63,62.1 v63.32,62.1 | R32.2 v21.5,68.33 21.5,68.11 10.11,56.72 v10.11,51.95
  Bottom 0.254: v113,42 113,43.5 111,45.5 106.5,45.5 106,46 106,47 99.5,53.5 83.5,53.5 82,55 81.28,55 | 81.28,55 78,55 v76.5,53.5 | JP19.12 81.28,55 | v9.4,37.59 9.91,38.1 9.91,51.75 v10.11,51.95 | v63.32,62.1 63.12,62.1 62.36,62.87 61.72,62.87 61.21,63.37 51.56,63.37 51.18,63.75 48.01,63.75 47.24,64.52 43.05,64.52 42.04,65.53 35.81,65.53 35.31,65.02 34.67,65.02 32.38,67.31 22.52,67.31 v21.5,68.33
D6-DIR-Y  (via drill 0.51)
  Top 0.254: U8.3 37.08,34.42 34.29,37.21 v34.29,38.1 | U1.10 113.5,41 114,41.5 v114,43.5 | v34.8,51.31 35,51.51 v35,66.04 R42.2 | v74,54 71.98,54 71.12,54.86 71.12,55.37 70.1,56.39 70.1,57.66 65.66,62.1 64.52,62.1 v63.25,63.37
  Bottom 0.254: v114,43.5 111.5,46 107,46 106.5,46.5 106.5,47.5 100,54 84,54 82.5,55.5 77,55.5 75.5,54 74.93,54 | 74.93,54 v74,54 | JP19.11 80.01,48.26 74.93,53.34 74.93,54 | v34.29,38.1 34.8,38.61 v34.8,51.31 | v63.25,63.37 61.98,63.37 61.47,63.88 51.82,63.88 51.44,64.26 48.26,64.26 47.5,65.02 43.31,65.02 42.29,66.04 v35,66.04
D7-DIR-Z  (via drill 0.51)
  Top 0.254: U9.3 61.58,34.42 61.58,34.44 v58.42,37.59 | R46.2 48.5,65.29 v48.51,65.28 | U1.11 114.3,40.8 115,41.5 v115,42.5 | v75,55 73.5,55 73,54.5 72.25,54.5 71.63,55.12 71.63,55.63 70.61,56.64 70.61,57.91 65.91,62.61 64.77,62.61 64.39,62.99 64.39,63.75 63.78,64.36 v62.27,64.36 | v58.93,51.13 58.93,59.56 55.24,63.25 v55.24,64.77
  Bottom 0.254: v115,42.5 115,44 112.5,46.5 107.5,46.5 107,47 107,48 100.5,54.5 84.5,54.5 83,56 76,56 v75,55 73.5,55 73.15,54.65 73.15,53.34 73.41,53.09 74.42,53.09 81.28,46.23 JP19.10 | v58.42,37.59 58.93,38.1 v58.93,51.13 | v62.27,64.36 61.87,64.77 v55.24,64.77 53.47,64.77 53.09,64.39 52.07,64.39 51.18,65.28 v48.51,65.28
D8-STEP_EN  (via drill 0.6)
  Top 0.254: 113.54,36.83 112.96,36.26 112.96,34.92 112.66,34.62 U7.1 | 113.54,36.83 115.1,38.39 U1.12 | v114.3,36.07 113.54,36.83
D9-LIM-X  (via drill 0.51, 0.6)
  Top 0.254: U1.13 115.9,34.37 v114.55,33.02 | v109.73,27.94 109.47,27.69 U6.2 | U6.2 | U6.2 102.36,27.69 92.71,18.03 81.79,18.03 78.49,21.34 78.49,54.61 66.04,67.06 v66.04,67.82 | v29.46,68.83 29.46,70.61 R31.2
  Bottom 0.254: v114.55,33.02 114.55,32.77 v109.73,27.94 | v66.04,67.82 65.15,66.93 62.99,66.93 62.61,67.31 43.69,67.31 42.16,68.83 v29.46,68.83
D10-LIM-Y  (via drill 0.51, 0.6)
  Top 0.254: 106.17,25.15 100.58,25.15 92.96,17.53 81.53,17.53 77.98,21.08 77.98,54.36 64.52,67.82 v63.5,67.82 | 106.17,25.15 U6.4 | U1.14 116.7,33.64 v116.08,33.02 | v110.49,25.91 109.73,25.15 106.17,25.15 | v43.05,69.22 43,69.27 R41.2
  Bottom 0.254: v116.08,33.02 115.82,33.02 114.55,31.75 114.3,31.75 112.52,29.97 112.52,27.94 v110.49,25.91 | v63.5,67.82 44.45,67.82 v43.05,69.22
D+
  Top 0.254: U2.15 134.22,24.77 139,20 140.25,20 JP5.D+
D-
  Top 0.254: JP5.D- 139.52,18.78 133.57,24.73 U2.16
DTR
  Top 0.254: U2.2 126.42,24.07 125.85,24.65 C52.2
ESTOP
  Top 0.254: R48.2 116,18.11 114.55,19.56 112.01,19.56 111,20.57 111,24.89 111.25,25.15 U6.11
  Top 0.406: R48.2 C58.1
ESTOP-LOGIC  (via drill 0.51)
  Top 0.178: U7.2
  Top 0.254: U6.10 114.29,23.86 116.84,26.42 116.84,29.46 113.54,32.77 112.27,32.77 112.01,33.02 U7.2 | 90.93,70.22 90.93,69.09 91.69,68.33 96.01,68.33 99.31,65.02 99.31,55.12 96.52,52.32 v96.52,51.82 92.96,48.26 JP2.4 | 90.93,70.36 90.93,70.22 | 90.93,70.22 R40.2 | v112.01,35.81 U7.2
  Bottom 0.254: v96.52,51.82 96.52,44.2 103.38,37.34 103.38,36.58 104.14,35.81 v112.01,35.81
GND  (via drill 0.38, 0.51, 0.51 pad 0.25, 1 pad 1.78)
  Top 0.203: U3.3 107.95,31.81 107.89,31.88 107.89,32.26 107.57,32.58 106.05,32.58
  Top 0.254: 122.3,73.15 121.94,73.15 U4.7 121.94,71.09 121.92,71.09
  Top 0.61: 40.55,36.58 40.39,36.58 | 64.94,36.58 65.02,36.58 | 15.91,36.58 16,36.58
  other vias: 128,64.5 128,66 128,67.5 128,69 129.5,70 131.5,70 133,69 133,67.5 133,66 133,64.5 26,27 26,25.5 24.5,25.5 24.5,27 49.5,26.5 51,26.5 51,25 49.5,25 73.63,25 73.63,26.5 75,26.5 75,25 29,24.5 30,23 30.99,21.98 93.98,52.5 142.94,36.4 144.22,36.4 144.22,34.62 142.94,34.62 123.64,51.9 125.42,51.9 125.42,50.12 123.64,50.12 82.55,67.74 83.82,67.74 83.82,70.79 82.55,70.79 122.37,39.7 123.38,38.18 125.62,27.21 127.65,27.21 126.64,25.68 124.1,22.64 129.18,23.65 131.21,25.18 120.95,70.08 120.95,69.29 121.92,69.29 121.92,70.08 114.7,26.19 106.06,40.92 106.06,42.19 98.44,40.42 109.36,49.05 105.3,33.05 109.36,36.86 105.81,36.86 109.36,29.49 115.71,23.91 118.25,26.95 121.3,24.92 121.3,20.86 117.49,21.37 71.37,68.07 71.37,69.34 71.37,70.61 72.64,70.61 73.91,70.61 75.18,70.61 76.45,70.61 77.72,70.61 78.99,70.61 134.62,45.97 122.43,7.37 115.57,7.37 18.15,20.17 19.93,20.17 18.91,19.4 11.47,42.5 35.06,25.29 35.06,24.02 35.06,22.75 35.06,21.48 59.51,23.48 26.2,37.05 25.57,38.07 41.66,58.04 42.67,58.04 43.69,58.04 44.7,58.04 48.64,58.04 49.66,58.04 50.67,58.04 59.94,58.04 59.94,59.05 59.94,60.07 57.02,57.91 57.02,58.93 57.02,59.94 19.94,59.56 20.95,59.56 21.97,59.56 22.99,59.56 18.92,59.56 20.95,79.5 21.97,79.5 22.99,79.5 24,79.5 38.48,79.5 39.5,79.5 40.51,79.5 37.47,79.5 57.02,79.5 56.01,79.5 54.99,79.5 53.98,79.5 59.31,68.83 60.33,68.83 61.34,68.83 62.36,68.83 18.8,8.38 19.81,8.38 20.83,8.38 21.84,8.38 59.82,8.38 58.8,8.38 57.78,8.38 56.77,8.38 39.75,8.38 38.73,8.38 37.72,8.38 40.77,8.38 30.73,48.9 28.7,48.9 54.99,48.9 52.96,48.9 28.7,49.91 30.73,49.91 52.96,49.91 54.99,49.91 27.69,48.9 27.69,49.91 31.75,49.91 31.75,48.9 56.01,49.91 56.01,48.9 51.94,48.9 51.94,49.91 102.25,36.86 100.22,21.11 102.76,21.11
  pour Top (isolate 0.203, rank 6): 0,0 149.86,0 149.86,82.04 0,82.04
  pour Bottom (isolate 0.254, rank 6): 0,0 149.86,0 149.86,82.04 0,82.04
  pour Top (isolate 0.203): 123,68.2 123,66.3 122.2,66.3 122.2,68.2
  pour Top (no thermals): 64.26,40.13 66.04,40.13 66.04,37.08 64.26,37.08
  pour Top (no thermals): 39.88,40.13 41.66,40.13 41.66,37.08 39.88,37.08
  pour Top (no thermals): 15.24,40.13 17.02,40.13 17.02,37.08 15.24,37.08
MISO-D12-LIMIT-Z  (via drill 0.51)
  Top 0.254: U1.16 118.3,37.15 J1.1 | v108.46,21.08 108.71,21.34 108.71,22.1 108.22,22.59 U6.6 98.8,22.59 93.22,17.02 81.28,17.02 77.47,20.83 77.47,54.1 64.64,66.93 59.18,66.93 56.5,69.61 R45.2 | v120.65,27.18 v120.65,29.72
  Bottom 0.254: v108.46,21.08 109.22,20.32 115.06,20.32 120.65,25.91 v120.65,27.18 | v120.65,29.72 120.65,34.8 J1.1
MOSI-D11-SPINDLE_PWM  (via drill 0.51)
  Top 0.254: U1.15 117.5,32.61 v117.6,32.51 117.86,32.26 120.65,32.26 J1.4 | v102.62,32.51 102.62,31.24 92.46,21.08 92.2,21.08 JP2.26
  Bottom 0.254: v102.62,32.51 104.65,34.54 111,34.54 111.25,34.29 116.59,34.29 117.6,33.27 v117.6,32.51
N$1
  Top 0.254: U2.1 125.78,20.15 R58.2
N$2
  Top 0.406: R9.1 D2.A
N$3
  Top 0.406: R18.1 D1.A
N$4  (via drill 0.51, 1 pad 1.78)
  Top 0.254: JP1.1 93.82,8.03 v94.49,7.37 | JP3.1 100.82,8.14 v101.6,7.37 | JP4.1 107.82,8.26 v108.71,7.37
  Top 0.406: v133.9,14.22 S5.5
  Bottom 0.406: JP1.1 96.01,12.19 100.82,12.19 | 100.82,12.19 107.82,12.19 | 107.82,12.19 JP4.1 | JP3.1 100.82,12.19 | 107.82,12.19 130.05,12.19 132.08,14.22 v133.9,14.22
N$5
  Top 0.406: R40.1 D7.A
N$6
  Top 0.254: U1.8 110.04,41.2 109.02,40.17
N$7  (via drill 1 pad 1.78)
  Top 0.254: JP1.2 97.68,8.02 v97.03,7.37
  Top 0.406: R38.2 R30.1 97.52,10.16 JP1.2
N$8
  Top 0.254: U1.7 110,42 109.43,42.57 109.02,42.57
N$9
  Top 0.406: POT1.3 R37.1
N$10
  Top 0.406: POT1.1 R1.2 12.5,45
N$11
  Top 0.254: U8.6 30.88,32.48 R4.2
  Top 0.406: R4.2 C12.1
N$12
  Top 0.254: U8.9 33.02,30.52 32,29.5 31,29.5 R5.2
  Top 0.406: C13.1 30.85,29.35 31,29.5
N$13
  Top 0.406: R44.1 D11.A
N$14
  Top 0.254: U8.5 32.88,33.12 32,34 R8.2
  Top 0.406: R8.2 C15.1 R7.1
N$15  (via drill 0.51, 0.6)
  Top 0.254: U8.13 36.42,27.93 v36,27.5 | S2.2 31.24,44.18 v31.24,45.97
  Bottom 0.254: v36,27.5 31,32.5 31,43.94 S2.2
N$16
  Top 0.406: R49.1 D15.A
N$17  (via drill 0.6)
  other vias: 144.02,61.21
  pour Top (isolate 0.254): 150,42 143.5,42 143.5,50.5 127,50.5 127,62 150,62
N$18
  Top 0.406: R31.1 D6.A
N$19
  Top 0.406: R32.1 D5.A
N$20
  Top 0.406: R39.1 D4.A
N$21
  Top 0.254: U4.6 124.27,72.08 R52.1 R53.1
N$22
  Top 0.406: R41.1 D10.A
N$23  (via drill 0.51, 0.6)
  Top 0.254: U8.12 35.58,28.57 v34.5,27.5 | S2.1 28.19,44.23 v28.19,45.97
  Bottom 0.254: v34.5,27.5 30,32 30,42.43 S2.1
N$24
  Top 0.254: U5.24 22.62,33.12 23.5,34 25.5,34 25.85,33.65 C16.1
N$25
  Top 0.254: U5.23 23.62,32.48 C16.2
N$26
  Top 0.254: U8.20 47.48,30.52 48,30 C8.2
N$27  (via drill 0.51, 0.64)
  Top 0.254: U8.8 35.81,31.18 v35.48,31.5 | v38,48.5 POT2.2
  Bottom 0.254: v35.48,31.5 33.73,33.25 33.73,35.76 35.31,37.34 35.31,45.81 v38,48.5
N$28
  Top 0.254: 13.51,32.5 C21.1
  Top 0.305: U5.6 13.51,32.5
  Top 0.406: R12.2 C21.1
N$29
  Top 0.254: U5.9 8.53,30.52 7.5,29.5 R13.2
  Top 0.406: C22.1 R13.2
N$30
  Top 0.254: U5.5 8.38,33.12 7.5,34 R15.2
  Top 0.406: C32.1 R14.1 R15.2
N$31
  Top 0.406: R42.1 D9.A
N$32
  Top 0.254: U2.23 129.03,30.18 128,31.2 128,31.9 | 128,31.9 127.9,32 | 128,31.9 D1.C
N$33
  Top 0.254: U2.22 129.68,30.18 130.5,31 D2.C
N$34  (via drill 0.51, 0.6)
  Top 0.254: U5.13 11.93,27.93 v11.5,27.5 | S1.2 6.35,44.04 v6.35,45.97
  Bottom 0.254: v11.5,27.5 6.5,32.5 6.5,43.71 S1.2
N$35  (via drill 0.51, 0.6)
  Top 0.254: U5.12 12.57,28.57 12.5,28.5 11,28.5 v10,27.5 | S1.1 3.56,44.12 v3.56,45.97
  Bottom 0.254: v10,27.5 5.5,32 5.5,42.17 S1.1
N$36
  Top 0.406: R43.1 D8.A
N$37  (via drill 1 pad 1.78)
  Top 0.305: U5.11 13.52,29.21 12.19,29.21
  other vias: 20.57,14.22
  pour Top: 21.59,10.16 21.59,15.24 16.76,15.24 9.14,22.86 9.14,27.18 10.67,28.7 12.7,28.7 12.7,29.72 9.14,29.72 7.62,28.19 7.62,21.08 18.54,10.16
N$38
  Top 0.254: U5.20 19.5,30.5 23,30.5 23.5,30 C18.2
N$39
  Top 0.254: Q2.1 135.54,67 135.5,67
  Top 0.406: R50.2 136.16,66.62 135.78,67 135.5,67
N$40
  Top 0.406: R45.1 D14.A
N$41
  Top 0.406: D3.C 144.5,52 143.85,52.65 R51.2
N$42  (via drill 1 pad 1.78)
  Top 0.254: JP3.2 104.68,7.9 v104.14,7.37
  Top 0.406: R27.2 R33.1 103.51,11.17 JP3.2
N$43  (via drill 1 pad 1.78)
  Top 0.254: JP4.2 111.68,7.79 v111.25,7.37
  Top 0.406: R34.1 109.5,15 | R28.2 109.35,15.15 109.5,15 | 109.5,15 109.5,12.18 JP4.2
N$45
  Top 0.406: R16.1 39,47 POT2.3 39,47.5
N$46
  Top 0.406: R17.2 POT2.1
N$47
  Top 0.254: U8.22 48.33,31.82 C6.2
N$48
  Top 0.254: U8.24 47.12,33.12 48,34 | 48,34 50,34 | 50,34 50.35,33.65 C1.1 | 48,34 50,34
N$49
  Top 0.254: U8.23 48.12,32.48 C1.2
N$50  (via drill 1 pad 1.78)
  Top 0.305: U8.11 36.73,29.23
  other vias: 34.8,14.22
  pour Top: 35.56,10.16 35.56,16.26 33.78,18.03 33.78,27.43 35.31,28.96 37.59,28.96 37.59,29.97 33.78,29.97 32.26,28.45 32.26,10.16
N$51
  Top 0.813: D16.A F1.2
N$53  (via drill 1 pad 1.78)
  Top 0.254: JP8.2 125.68,8.08 v124.97,7.37
  Top 0.406: R36.1 122.5,15 | R29.2 122.35,15.15 122.5,15 | 122.5,15 122.5,13.18 JP8.2
N$55  (via drill 1 pad 1.78)
  Top 0.305: U8.18 46.27,29.23
  Top 0.61: 37.34,11.84 Y-B.2 37.68,11.52
  other vias: 37.34,14.22
  pour Top (rank 2): 36.07,10.16 39.12,10.16 39.12,14.99 40.13,16 44.45,16 48.01,19.56 48.01,28.45 46.74,29.72 44.7,29.72 44.7,28.96 45.97,27.69 45.97,24.38 45.21,23.62 45.21,20.83 43.43,19.05 39.37,19.05 36.07,15.49
N$56  (via drill 0.51, 1 pad 1.78)
  Top 0.305: U8.4 36.23,33.77 v36,34
  Top 0.61: Y-A.1 41.66,12.33 v41.66,14.22
  other vias: 34.98,34 34.98,35.02
  pour Bottom (rank 3): 38.86,32.51 35.81,35.56 34.29,35.56 34.29,33.27 35.31,33.27 36.83,31.75 36.83,17.78 39.37,15.24 39.37,10.16 42.93,10.16 42.93,14.99 38.86,19.05
  pour Top: 35.81,35.56 37.08,34.29 37.08,33.27 34.29,33.27 34.29,35.56
N$57  (via drill 1 pad 1.78)
  Top 0.254: JP9.2 118.68,7.93 v118.11,7.37
  Top 0.406: R48.1 116,15 | R35.2 115.85,15.15 116,15 | 116,15 116,12.68 JP9.2
N$58  (via drill 0.51, 1 pad 1.78)
  Top 0.305: U8.25 46.27,33.77 v46.5,34
  Top 0.61: v44.2,14.22 44.2,11.98 Y-A.2
  Bottom 0.61: 44.2,11.98 Y-A.2
  other vias: 47.26,34.76 48.28,35.02
  pour Top: 44.7,34.29 45.47,34.29 46.74,35.56 49.02,35.56 49.28,35.31 49.28,34.29 48.01,34.29 46.99,33.27 44.7,33.27
  pour Bottom (rank 2): 45.72,29.21 45.72,34.54 46.99,35.81 48.51,35.81 49.28,35.05 49.28,34.29 47.75,32.77 47.75,22.35 46.23,20.83 46.23,10.16 42.93,10.16 42.93,16.51 42.42,17.02 42.42,20.83 45.97,24.38 45.97,28.96
N$59
  pour Top: 39,27.5 37,27.5 36,26.5 36,21.96 37,20.96 39.22,20.96 39.22,25.5 39,25.5
N$62
  Top 0.406: D18.A 144.8,68.1 144.5,68.4 142.85,68.4 R56.2
N$63
  Top 0.406: R46.1 D13.A
N$64
  Top 0.406: R47.1 D12.A
N$65
  Top 0.254: U2.5 128.38,20.72 128.87,20.23 R57.2
N$66
  Top 0.254: U4.2 R55.1 121,65.5
N$67
  Top 0.254: U5.22 23.82,31.82 C17.2
N$68
  Top 0.254: U4.10 119.07,72.08 C7.1
N$69  (via drill 1 pad 1.78)
  Top 0.305: U5.18 21.77,29.23
  Top 0.61: X-B.2 23.68,13.66 v23.11,14.22
  pour Top (rank 2): 25.15,10.16 22.1,10.16 22.1,15.24 20.83,16.51 20.83,22.61 21.34,23.11 21.34,28.7 20.32,28.7 20.32,29.72 22.35,29.72 23.11,28.96 23.11,22.61 25.15,20.57
N$70
  Top 0.254: U4.9 120.94,73.28 120.65,73.28
  Top 1.778: 115.2,76 117.8,76
  pour Top (isolate 0.254, rank 2): 110.62,63.5 117.09,63.5 117.09,72.01 117.98,72.9 120.78,72.9 120.78,71.75 121.03,71.75 121.03,78.74 110.62,78.74
N$71  (via drill 0.51, 1 pad 1.78)
  Top 0.305: U5.4 11.72,33.77 v11.5,34
  Top 0.61: X-A.1 27.69,12.36 v27.69,14.22
  other vias: 10.74,34.76 9.98,34
  pour Top: 12.7,33.53 12.7,34.29 11.43,35.56 10.16,35.56 9.4,34.8 9.4,33.53
  pour Bottom (rank 2): 9.4,33.27 9.14,33.53 9.14,35.31 9.65,35.81 10.92,35.81 14.48,32.26 14.48,22.35 18.8,18.03 25.91,18.03 28.7,15.24 28.7,10.16 25.65,10.16 25.65,13.97 23.88,15.75 18.8,15.75 12.45,22.1 12.45,31.75 10.92,33.27
N$72
  pour Top (isolate 0.254): 38.75,35.5 37,35.5 36,36.5 36,40.02 37.76,41.79 38.92,41.79 38.92,37.5 38.75,37.5
N$73
  Top 0.254: U9.6 55.38,32.48 R21.2
  Top 0.406: C33.1 R21.2
N$74
  Top 0.254: U9.9 57.52,30.52 56.5,29.5 C34.1
  Top 0.406: R22.2 C34.1
N$75
  Top 0.254: U9.5 57.38,33.12 56.5,34 R24.2 55,34
  Top 0.406: R24.2 C36.1 R23.1
N$76  (via drill 0.51, 0.6)
  Top 0.254: U9.13 60.92,27.93 v60.5,27.5 | S3.2 55.37,44.32 v55.37,46.23
  Bottom 0.254: v60.5,27.5 55.5,32.5 55.5,43.97 S3.2
N$77  (via drill 0.51, 0.6)
  Top 0.254: U9.12 60.08,28.57 v59,27.5 | S3.1 52.32,44.6 v52.32,46.23
  Bottom 0.254: v59,27.5 54.5,32 54.5,42.43 S3.1
N$78
  Top 0.254: U4.4 121.94,66.06 122.35,65.65 C9.1
N$79  (via drill 0.51, 1 pad 1.78)
  Top 0.305: U5.25 21.77,33.77 v22,34
  Top 0.61: X-A.2 30.23,11.95 v30.23,14.22
  Bottom 0.61: 30.23,14.73 v30.23,14.22
  other vias: 22.76,34.76 23.78,35.02
  pour Top: 20.32,34.29 20.32,33.27 22.61,33.27 23.62,34.29 24.64,34.29 24.64,35.81 22.61,35.81 21.08,34.29
  pour Bottom (rank 3): 21.08,34.29 22.86,36.07 24.64,36.07 24.64,34.29 24.13,34.29 23.37,33.53 23.37,23.62 32,14.99 32,10.16 29.21,10.16 29.21,14.99 25.91,18.29 23.37,18.29 21.08,20.57
N$80
  Top 0.254: U9.20 71.97,30.52 72.5,30 C29.2
N$81  (via drill 0.51, 0.64)
  Top 0.254: U9.8 61.33,31.18 v61,31.5 | v62.5,48.5 POT3.2
  Bottom 0.254: v62.5,48.5 59.5,45.5 59.5,36.13 57.91,34.54 57.91,33.53 59.94,31.5 v61,31.5
N$82
  Top 0.406: R25.1 POT3.3
N$83
  Top 0.406: 61.5,47.5 POT3.1 R26.2
N$84
  Top 0.254: U9.22 72.67,31.82 73,31.5 C28.2
N$85
  Top 0.254: U9.24 71.62,33.12 72.5,34 74.5,34 74.85,33.65 C27.1
N$86
  Top 0.254: U9.23 72.62,32.48 C27.2
N$87  (via drill 1 pad 1.78)
  Top 0.305: U9.11 61.21,29.23 61.21,29.21
  Top 0.61: Z-B.1 48.51,12.19
  other vias: 48.51,14.22
  pour Top: 61.47,29.72 61.47,28.7 59.69,28.7 58.42,27.43 58.42,24.13 49.53,15.24 49.53,10.16 46.23,10.16 46.23,15.24 56.64,25.65 56.64,28.45 57.91,29.72
N$88  (via drill 1 pad 1.78)
  Top 0.305: U9.18 69.85,29.23 69.85,29.21
  other vias: 51.05,14.22
  pour Top (rank 2): 50.04,10.16 53.34,10.16 53.34,14.99 57.4,19.05 69.85,19.05 71.37,20.32 71.37,23.62 72.14,24.38 72.14,28.96 71.37,29.72 69.34,29.72 69.34,28.96 70.1,28.96 70.61,28.45 70.61,24.64 69.6,23.62 69.6,22.1 68.58,21.08 61.72,21.08 60.96,21.84 56.9,21.84 50.04,14.99
N$89  (via drill 0.51, 1 pad 1.78)
  Top 0.305: U9.4 60.73,33.77 v60.5,34
  Top 0.61: Z-A.1 55.63,12.3 v55.63,14.22
  Bottom 0.61: 55.63,12.3 Z-A.1
  other vias: 59.74,34.76 58.98,34
  pour Top: 61.72,33.27 61.72,34.29 60.45,35.56 59.44,35.56 58.17,34.29 58.17,33.27
  pour Bottom: 53.59,14.48 53.59,10.16 56.64,10.16 56.64,14.99 57.91,16.26 60.71,16.26 63.5,19.05 63.5,33.53 62.99,34.04 61.72,34.04 60.2,35.56 59.18,35.56 58.17,34.54 58.17,33.78 58.93,33.02 60.2,33.02 61.47,31.75 61.47,21.34 58.67,18.54 57.66,18.54
N$90  (via drill 0.51, 1 pad 1.78)
  Top 0.305: U9.25 70.78,33.77 v71,34
  Top 0.61: Z-A.2 58.17,12.01 v58.17,14.22
  other vias: 71.76,34.76 72.78,35.02
  pour Top: 69.34,34.29 69.34,33.27 71.63,33.27 72.39,34.04 73.15,34.04 73.41,34.29 73.41,35.56 73.15,35.81 71.88,35.81 71.37,35.31 70.36,35.31
  pour Bottom (rank 2): 57.15,10.16 57.15,14.99 57.91,15.75 60.96,15.75 70.1,24.89 70.1,34.54 71.37,35.81 73.41,35.81 73.66,35.56 73.66,34.04 72.64,33.02 72.64,22.61 60.2,10.16
N$91
  pour Top: 63.5,27.43 61.47,27.43 60.96,26.92 60.96,22.61 62.23,21.34 63.5,21.34
N$92
  pour Top: 14.25,27.5 12.5,27.5 10.99,25.99 10.99,22.47 12.5,20.96 13.96,20.96 13.96,25.5 14.25,25.5
N$93
  pour Top (isolate 0.254): 63.25,35.5 61.5,35.5 60.5,36.5 60.5,40.02 62.26,41.79 63.42,41.79 63.42,37.5 63.25,37.5
N$94  (via drill 0.51, 0.64)
  Top 0.254: U5.8 12.32,31.18 v12,31.5 | v13.5,48.5 POT1.2
  Bottom 0.254: v13.5,48.5 10.41,45.41 10.41,36.83 8.89,35.31 8.89,33.53 10.92,31.5 v12,31.5
N$95  (via drill 0.51)
  Top 0.254: v101.51,18.5 R27.1 | R28.1 v107.5,18.5 | R38.1 95.52,17.99 v96.02,18.5
  Top 0.406: S5.2 129.03,14.22 128.52,14.73 128.52,15.75 v127.51,16.76
  Bottom 0.406: v127.51,16.76 109.24,16.76 v107.5,18.5 107.03,18.03 102.11,18.03 101.64,18.5 v101.51,18.5 v96.02,18.5
N$96
  pour Top (isolate 0.254): 14.25,35.5 12.5,35.5 11.5,36.5 11.5,40.28 13.01,41.79 14.42,41.79 14.42,37.5 14.25,37.5
N$97
  Top 0.254: U4.8 121.44,74.61 R54.2
  pour Top: 121.28,73.66 122.9,73.65 122.94,75.31 125.22,75.31 125.22,78.23 121.28,78.23
N$98
  Top 0.254: U2.17 132.93,31.24 C47.1
PROBE  (via drill 0.51)
  Top 0.254: U6.9 115.82,22.59 | 115.82,22.59 117.91,22.59 122.5,18 R36.2 | D11.C 95,75.95 93.73,74.68 93.73,69.85 94.74,68.83 96.27,68.83 99.82,65.28 99.82,54.36 v97.79,52.32 | v104.39,37.08 104.39,31.75 v101.6,28.96 | v115.82,19.81 115.82,22.59
  Top 0.406: R36.2 C57.1
  Bottom 0.254: v97.79,52.32 97.79,43.69 v104.39,37.08 | v101.6,28.96 101.6,20.07 102.87,18.8 106.17,18.8 106.93,19.56 115.57,19.56 v115.82,19.81
RESET  (via drill 0.51, 1 pad 1.78)
  Top 0.254: 126,40.3 126,31 123.5,28.5 C52.1 123.5,26.23 120.24,26.23 119.38,27.09 J1.5 | 126,40.3 126.71,41.01 | 126.71,41.01 126.71,41 R6.1 | 126.71,41.01 S4.3 | v115.5,46.5 115.1,46.9 U1.29 115.1,49.4 113.5,51 105.36,51 94.49,40.13 94.49,33.53 JP2.18 | v122.5,41.5 123.7,40.3 126,40.3 | v134.62,43.43 134.37,43.69 127.25,43.69 126.75,43.18 126.75,42.67
  Top 0.61: S4.3 126.73,42.67 126.75,42.67
  Bottom 0.254: v115.5,46.5 120.5,41.5 v122.5,41.5
RXI  (via drill 0.51)
  Top 0.254: U1.30 114.3,49.2 113,50.5 105.62,50.5 95,39.88 95,32 92.2,29.21 90.68,29.21 90.17,28.7 90.17,26.67 JP2.21 | R58.1 125.4,18.45 v125.4,13.9
  Bottom 0.254: v125.4,13.9 95.07,13.9 90.17,18.8 90.17,24.13 JP2.21
SCK-D13-SPINDLE_DIR  (via drill 0.51)
  Top 0.254: U1.17 119.79,37.69 120.65,36.83 120.65,34.8 J1.3 | v103.12,35.05 101.6,33.53 101.6,30.99 92.2,21.59 90.17,21.59 JP2.25
  Bottom 0.254: J1.3 118.11,34.8 111.51,34.8 111.25,35.05 v103.12,35.05
STEP-EN_LED  (via drill 0.51)
  Top 0.203: R49.2 99,66.86 100.33,65.53 100.33,53.59 v99.19,52.45 | U3.4 107.9,36.37 v107.31,36.96
  Bottom 0.203: v107.31,36.96 99.19,45.09 v99.19,52.45
STEP_ENABLE  (via drill 0.51)
  Top 0.203: U5.26 21.09,34.42 23.24,36.58 25.15,36.58 27.56,34.16 27.56,23.88 v31.24,20.19 | v48.26,36.32 47.62,35.69 46.74,35.69 45.47,34.42 U8.26 | U9.26 69.73,34.42 70.61,35.31 71.12,35.31 72.39,36.58 75.18,36.58 76.58,35.18 v76.58,26.67 v76.58,18.67 60.33,18.67 v59.69,19.3 | v79.5,26.67 79.5,33.78 JP19.6 | v81.79,19.56 82.8,18.54 92.46,18.54 104.65,30.73 107.25,30.73 | U7.4 111.38,31.8 111.38,31.05 111.06,30.73 107.25,30.73 | U3.2 107.25,30.73 | v35.81,17.91 37.97,17.91 39.37,19.3 44.32,19.3 v44.96,19.94
  Bottom 0.203: v76.58,26.67 v79.5,26.67 | v59.69,19.3 59.05,19.94 48.39,19.94 v44.96,19.94 | v76.58,18.67 80.9,18.67 v81.79,19.56 | v35.81,17.91 33.53,17.91 v31.24,20.19
  Bottom 0.254: 48.39,19.94 48.39,27.3 48.01,27.69 48.01,32.51 49.53,34.04 49.53,35.05 v48.26,36.32
TXO  (via drill 0.51)
  Top 0.254: U1.31 113.5,49 112.5,50 105.88,50 95.5,39.62 95.5,31.75 93.73,29.97 93.73,27.69 JP2.22 | R57.1 127.17,18.71 126.3,17.84 v126.3,15
  Bottom 0.254: v126.3,15 125.2,15 124.6,14.4 95.58,14.4 92.96,17.02 92.96,23.88 JP2.22
VCC
  Top 0.813: C42.1 85.6,67.4 87.21,65.79 95.37,65.79 JP15.2
  Top 1.016: C42.1 85.32,69.28 U10.2 81.78,69.28 81,68.5 81,64 83,62 83,54.67 86.87,50.8 86.87,47.75 JP2.5 JP2.7
VCC_USB  (via drill 0.51 pad 0.25)
  Top 0.254: U2.4 127.72,24.23 v130,26.5 130.97,27.48 U2.20
  Bottom 0.254: v135.5,26.5 v130,26.5
  pour Top (isolate 0.254): 139,20 140.5,20 140.5,28.5 134.5,28.5 134.5,25 134.5,24.5
VIN  (via drill 0.51, 0.51 pad 0.25)
  Top 0.254: C6.1 51,31.5 51.5,32 51.5,35.28 49.31,37.47 45.09,37.47 | C17.1 26.5,31.5 27,32 27,33.5 v25.5,35 | C28.1 75.5,31.5 76,32 76,33.5 v74.5,35
  Top 0.406: R50.1 140.82,64.92 140.9,65 | v141,54.5 141.15,54.35 R51.1 | VIN.2 146.47,63.65 C2.2 140.89,63.7 140.9,63.71 140.9,65 | R56.1 141.55,66.75 140.9,66.1 140.9,65
  Top 1.016: JP19.4 JP19.5 | JP2.3 JP2.1 v88.9,58.42 v88.9,59.69 | U10.1 84.38,64.72 v84.58,64.52
  Bottom 0.254: v74.5,35 71.5,38 v69.5,38 | v25.5,35 23.04,37.47 20.95,37.47
  Bottom 1.016: JP19.5 86.87,38.61 86.87,46.23 JP2.3 | v84.58,64.52 84.84,64.26
  other vias: 20.5,38 20.52,39.02 19.5,36.75 20.5,37 20.25,24.75 19.5,25.25 19.5,26.25 20.25,25.75 44.75,25 43.75,25 43.75,26 44.75,26 45,38 45.02,39.02 44,36.75 45,37 69.52,39.02 68.5,36.75 69.5,37 69.5,25 68.5,25 68.5,26 69.5,26 118.2,61.2 119.5,61.2 120.8,61.2 118.2,59.9 119.5,59.9 118.2,57.4 119.5,57.4 118.2,58.6 119.5,58.6
  pour Bottom (isolate 0.254): 150,42 136.5,42 136.5,67.5 150,67.5
  pour Top (isolate 0.254): 19,35.5 20.5,35.5 21,36 21,41.5 18.27,41.5 18.27,36.23
  pour Top: 19.5,27.5 20,27.5 20.75,26.75 20.75,21.5 17,21.5 17,25
  pour Bottom: 21,38.5 21,36.5 20,35.5 20,27.5 21,26.5 21,24 19,24 19,38.5
  pour Top: 43.75,27.5 45.01,27.5 45.5,27.01 45.5,20.23 42.26,20.23 42.26,26.02
  pour Top (isolate 0.254): 43.5,35.5 45,35.5 45.5,36 45.5,41.5 42.77,41.5 42.77,36.23
  pour Bottom: 21,38.5 21,36.5 20,35.5 20,27.5 21,26.5 21,24.5 19,24.5 19,38.5
  pour Bottom: 45.5,38.5 45.5,36.5 44.5,35.5 44.5,27.5 45.5,26.5 45.5,24.5 43.25,24.5 43.25,38.5
  pour Top (rank 3): 68.5,27.5 69.76,27.5 70,27.26 70,20.93 66.75,20.93 66.75,25.65
  pour Top: 68,35.5 69.5,35.5 70,36 70,41.5 67.02,41.5 67.02,36.48
  pour Bottom: 70,38.5 70,36.5 69,35.5 69,27.5 70,26.5 70,24.5 68,24.5 68,38.5
  pour Bottom (isolate 0.254): 17.76,36.74 18,36.5 21,36.5 21,53.19 42.26,53.19 42.26,36.74 42.5,36.5 46,36.5 46,53.19 63.79,53.19 63.79,53.13 66.76,50.15 66.76,36.74 67,36.5 70,36.5 75.08,35.04 75.11,57.47 86.49,57.72 86.71,57.5 138,57 137.5,62.5 91.27,62.49 88.26,65.5 72.6,65.5 62.99,56.15 16.26,56.15 16.26,38.23 17.65,36.83
  pour Top: 120.65,67.82 120.65,66.29 119.63,66.29 119.63,64.52 121.67,64.52 121.67,60.96 122.43,60.96 122.43,56.9 117.6,56.9 117.6,67.82
X_LIM  (via drill 0.51)
  Top 0.254: U6.1 106.17,28.96 | v104.39,28.96 106.17,28.96 | 106.43,28.96 106.17,28.96 | C54.1 99.52,18.49 100.84,19.81 v103.76,19.81
  Top 0.406: R30.2 C54.1
  Bottom 0.254: v103.76,19.81 103.76,28.32 v104.39,28.96
Y_LIM  (via drill 0.51)
  Top 0.254: C55.1 105.41,16.95 v105.41,19.81 | v108.08,26.42 108.07,26.41 U6.3
  Top 0.406: R33.2 C55.1
  Bottom 0.254: v105.41,19.81 108.08,22.48 v108.08,26.42
Z_LIM
  Top 0.254: U6.5 108.14,23.86 109.5,22.5 R34.2
  Top 0.406: R34.2 C56.1

## Text on the board
Bottom: v11
tPlace: E-Stop | Probe | Step En | X Direction | X Step | X Limit | Y Direction | Y Step | Y Limit | Z Direction | Z Step | Z Limit | POWER | + | Step Size | Step Size | Step Size | Stepoko | FULL | FULL | FULL | - | + | - | 1/2 | Powered by | 1/2 | 1/2 | 12V FAN | 1/4 | 1/4 | 1/4 | Current / Limit | Current / Limit | Current / Limit | 1/8 | 1/8 | 1/8 | Reverse / Protection | X DIRECTION | VIN | +5V | RESET | Y DIRECTION | VIN | E-STOP | GND | 0.0A | 2.0A | 0.0A | 2.0A | 0.0A | 2.0A | Z DIRECTION | +12V | RESET/ABORT | 16MHz | Z STEP | +12V | FEED_HOLD | RST | Y STEP | GND | CYCLE START / /RESUME | X STEP | GND | COOLANT / ENABLE | STEP / ENABLE | GND | A4 | TX | RX | VIN | GND | PROBE | VIN / +12-30V | VIN | GND | RESET | +5V | AREF | GND | GND | RXI | TXO | GND | A7 | A6 | SPINDLE / DIR | SPINDLE / PWM | ACTIVE / CLOSED | X-Axis | Y-Axis | Z-Axis | Limit Switch | ACTIVE / OPEN | B+ | B- | A+ | A- | B+ | B- | A+ | A- | B+ | B- | A+ | A- | X Limit | Y Limit | Z Limit | E-Stop | Probe
bPlace: ARDUINO MAP | + | D0- RX / D1- TX / D2- STEP X / D3- STEP Y / D4- STEP Z / D5- DIR X / D6- DIR Y / D7- DIR Z / D8- STEP EN / D9- LIM X / D10- LIM Y / D11- SPIN PWM / D12- LIM Z / D13- SPIN DIR / A0- RESET/ABORT / A1- FEED HOLD / A2- CYCLE START / A3- COOLANT EN / A4- UNUSED / A5- PROBE / A6- UNUSED / A7- UNUSED | - | + | - | 12V FAN | X DIRECTION | VIN | +5V | Y DIRECTION | VIN | E-STOP | Z DIRECTION | +12V | RESET/ABORT | Z STEP | +12V | FEED_HOLD | Y STEP | GND | CYCLE START / /RESUME | X STEP | GND | COOLANT / ENABLE | STEP / ENABLE | GND | A4 | VIN | GND | PROBE | VIN / +12-30V | VIN | GND | RESET | +5V | AREF | GND | GND | RXI | TXO | GND | A7 | A6 | SPINDLE / DIR | SPINDLE / PWM | X-Axis | Y-Axis | Z-Axis | B+ | B- | A+ | A- | B+ | B- | A+ | A- | B+ | B- | A+ | A- | X Limit | Y Limit | Z Limit | E-Stop | Probe
tDocu: Casey Kuhns